# Altium project PCB_Project.PrjPcb (part 2 of 2)
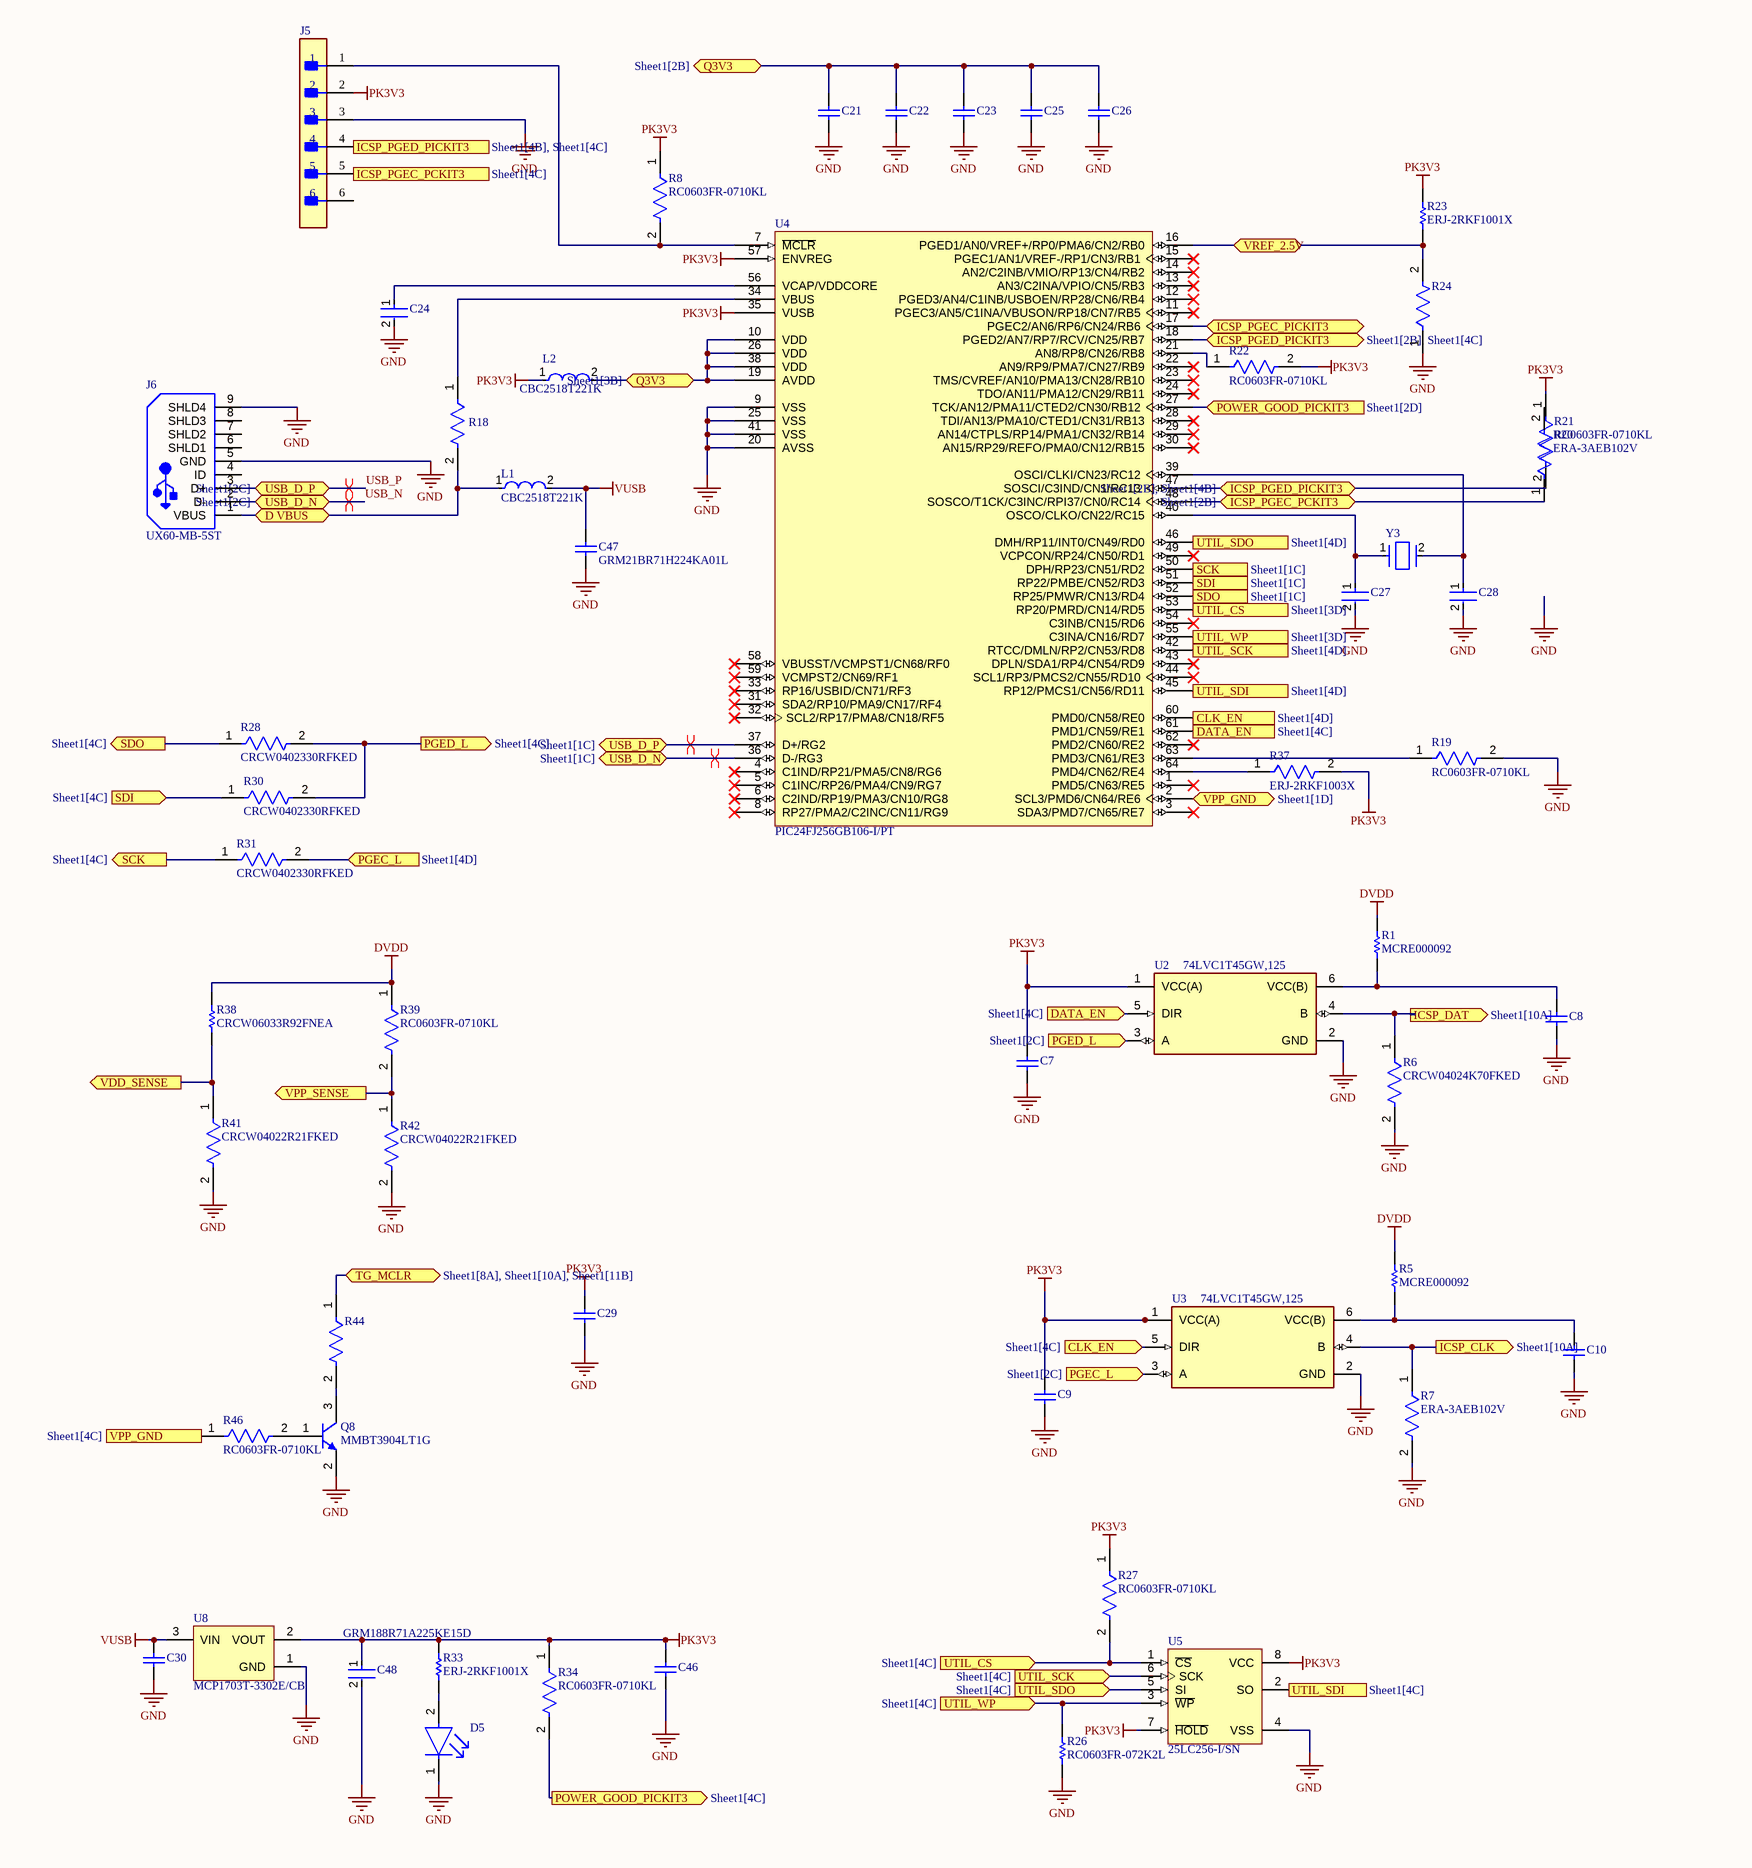
[diagram p3: Sheet1.SchDoc, bottom left]

## Sheet Sheet1.SchDoc (continued)

### Library data of the parts
C1 = CMP-1037-04981-1: CAP 10uF 25V -20% to +80% 1206 (3216 Metric) Thickness 1.9mm SMD; Case-EIA: 1206; Case-Metric: 3216; Value: 10uF; Tolerance: -20% to +80%; Max Thickness: 1.9 mm; Rated Voltage: 25 V; Technology: SMT
C2-C5 C7-C10 C21-C23 C25 C26 C29 C30 C46 = CMP-2100-03643-1: Chip Capacitor, 0.1 uF, +/- 10%, 50 V, -55 to 125 degC, 0603 (1608 Metric), RoHS, Tape and Reel; Manufacturer: Murata; Dielectric Material: Ceramic; Voltage Rating: 50V; Capacitance: 100nF; Dielectric: X7R; Insulation Resistance: 10GR; Case Code (Metric): 1608; Lead Free: LeadFree; Depth: 0.8mm; Number of Pins: 2; Radiation Hardening: No; Case/Package: 0603; Manufacturer URL: http://www.murata.com/; Packaging: TapeandReel; Length: 1.6mm; Contact Plating: Tin; Datasheet URL: http://psearch.en.murata.com/capacitor/product/GRM188R71H104KA93%23.pdf; Tolerance: 10%; Case Code (Imperial): 0603; Min Operating Temperature: -55degC; RoHSCompliant: true; Voltage: 50V; Termination: SMD/SMT; Mount: SurfaceMount; Material: Ceramic; Package Quantity: 1; Height: 0.8mm; Thickness: 0.035inch; REACH SVHC: NoSVHC; Max Operating Temperature: 125degC; Width: 0.8mm; Package Reference: 0603; Voltage Rating (DC): 50V; Datasheet Version: 42675.0; Package Description: 2-Pin Surface Mount Device, Body 1.6 x 0.8 mm
C11 C33 = CMP-2006-01581-1: Manufacturer: Vitramon; Part Number: VJ0603Y104JXACW1BC
C12 = CMP-1036-04555-1: CAP 220nF 50V ±20% 0805 (2012 Metric) Thickness 1mm SMD; Tolerance: Â±20%; Case-EIA: 0805; Case-Metric: 2012; Rated Voltage: 50 V; Max Thickness: 1 mm; Value: 220nF; Technology: SMT
C13 C14 = CMP-1659-00027-1: Chip Capacitor, 27 pF, +/- 5%, 50 V, -55 to 125 degC, 0603 (1608 Metric), RoHS, Tape and Reel; Capacitance: 10 uF; Tolerance: 10%; Voltage Rating (DC): 16 V; Case\Package: 1206; Type (Capacitors): X7R; Width: 1.6 mm; Pins: 2; Height: 1.6 mm; RoHSCompliant: true; PackageDescription: 2-Pin Surface Mount Device, Body 1.6 x 0.8 mm; Package Quantity: 2000; ComponentLink1Description: Manufacturer URL; Voltage Rating: 16 V; REACH SVHC: No SVHC; ComponentLink2Description: Datasheet; ComponentLink2URL: http://www.yageo.com/NewPortal/yageodocoutput?fileName=/pdf/MLCC/UPY-GP_NP0_16V-to-50V_14.pdf; Min Operating Temperature: -55 degC; PackageReference: 0603; Mount: Surface Mount; Case Code (Metric): 3216; Packaging: Tape and Reel; Radiation Hardening: No; DatasheetVersion: Rev. 14, 07/2016; Case Code (Imperial): 1206; ComponentLink1URL: http://www.yageo.com/; Max Operating Temperature: 125 degC; Length: 3.2 mm
C16 C19 = CMP-2000-06207-2: CAP ALUM 10UF 20% 50V SMD; Impedance: 880mR; Ripple Current: 165mA; Polarity: Polar; Leakage Current: 3uA; Lead Diameter: 0.65mm; Life (Hours): 2000Hour; REACH SVHC: No SVHC; Series: FK; Max Operating Temperature: 105°C; Radiation Hardening: No; Size: 5.8mm; Ripple Current (AC): 165mA; Lead Free: Lead Free; Voltage: 50V; Contact Plating: Tin; Case/Package: Radial; RoHS Compliant: Yes; Voltage Rating: 50V; Height - Seated (Max): 0.24inch; Package Quantity: 1000; Termination: SMD/SMT; Number of Pins: 2; Mount: Surface Mount; Packaging: Tape and Reel; Length: 5.8mm; Width: 7.8mm; Min Operating Temperature: -55°C; Height: 5.8mm; ESR (Equivalent Series Resistance): 880mR; Capacitance: 10uF; Diameter: 6.3mm; Voltage Rating (DC): 50V; Construction: Cylindrical; Tolerance: 20%; Lead Pitch: 1.8mm
C18 = CMP-2006-03061-2: CAP CER 0.1UF 50V X7R 0603; Manufacturer: KEMET; Manufacturer Part Number: C0603C104K5RACTU; Tolerance: 0.1; Description: C0603 0.10 μF X7R 30ppm/°C 10.00% 50 V; Temperature Coefficient: 30ppm/°C; Material: Ceramic; Automotive Grade: Grade 1; Value: 0.10 μF; Temperature: -55°C to +125°C; RoHS: TRUE; Temperature Range High: +125°C; Lead Free: Yes; Octopart: https://octopart.com/c0603c104k5ractu-kemet-139244; Digikey Description: CAP CER 0.1UF 50V X7R 0603; Category: Cap; Package: C0603C-CF; ComponentLink2Description: Datasheet; Temperature Range Low: -55°C; Device Class L1: Passive Components; Voltage Rating: 50 V; Automotive: Yes; Device Class L3: Ceramic Capacitors; ComponentLink2URL: https://api.kemet.com/component-edge/download/datasheet/C0603C100J5GACAUTO.pdf; Capacitance: 0.10 μF; Device Class L2: Capacitors; Temperature Characteristic: X7R; Height: 0.87mm
C20 = CMP-1036-03264-2: CAP CER 2200PF 50V X7R 0805; Manufacturer: Yageo; Capacitance: 2.2 nF; Tolerance: 0.1; Material: Ceramic; Value: 2.2 nF; Height: 0.95mm; Package: CC0805-0.85; Device Class L2: Capacitors; Lead Free: Yes; Device Class L1: Passive Components; Octopart: https://octopart.com/cc0805krx7r9bb222-yageo-192982; Temperature Range High: +85°C; Temperature Range Low: -30°C; Footprint Url: http://www.yageo.com/exep/pages/download/literatures/UPY-C_GEN_24.pdf; Temperature Characteristic: X7R; Manufacturer Part Number: CC0805KRX7R9BB222; Mouser Description: 2200pF Surface Mount, MLCC 0805 (2012 Metric) Package Ceramic Capacitors; Device Class L3: Ceramic Capacitors; RoHS: TRUE; Ipc Land Pattern Name: CAPC200125X85; ComponentLink2URL: http://www.yageo.com/documents/recent/UPY-GPHC_Y5V_6.3V-to-50V_8.pdf; Digikey Description: CAP CER 2200PF 50V X7R 0805; Temperature: -30°C to +85°C; Category: Cap; Automotive: No; Voltage Rating: 50 V; ComponentLink2Description: Datasheet
C24 = CMP-2007-03541-2: Chip Multilayer Ceramic Capacitors for General Purpose, 0805, 10uF, X5R, 15%, 10%, 25V; Length: 2mm; Depth: 1.25mm; Termination: SMD/SMT; Voltage: 25V; Height: 1.25mm; Material: Ceramic; Thickness: 0.053inch; Radiation Hardening: No; Min Operating Temperature: -55°C; Width: 0.049inch; Package Quantity: 1; Mount: Surface Mount; Dielectric: X5R; Packaging: Tape and Reel; Capacitance: 10uF; Voltage Rating (DC): 25V; Lead Free: Lead Free; Max Operating Temperature: 85°C; Case Code (Imperial): 0805; Case/Package: 0805; Tolerance: 10%; Voltage Rating: 25V; Case Code (Metric): 2012
C27 C28 = CMP-1034-00963-6: CAP CER 27PF 50V C0G/NP0 0402; Manufacturer: Kemet; Manufacturer Part Number: C0402C270J5GACTU; Temperature Coefficient: 15%; Tolerance: 0.05; Temperature Characteristic: C0G; Material: Ceramic; Device Class L1: Passive Components; Device Class L3: Ceramic Capacitors; RoHS: TRUE; Height: 0.55mm; Value: 27 pF; Device Class L2: Capacitors; Capacitance: 27 pF; Automotive: No; Octopart: https://octopart.com/c0402c270j5gactu-kemet-149444; Temperature: -55°C to +125°C; Temperature Range Low: -55°C; Package: C0402-BB; Ipc Land Pattern Name: CAPC10050X50; Category: Cap; Lead Free: Yes; Temperature Range High: +125°C; ComponentLink2URL: https://content.kemet.com/datasheets/KEM_C1002_X7R_SMD.pdf; ComponentLink2Description: Datasheet; Mouser Description: Multilayer Ceramic Capacitor, C Series, 27 pF, - 5%, C0G / NP0, 50 V, 0402 [1005 Metric]; Digikey Description: CAP CER 27PF 50V C0G/NP0 0402; Voltage Rating: 50 V
C31 = CMP-2006-02908-5: Chip Capacitor, 2.2 nF, +/- 10%, 50 V, -55 to 125 degC, 0603 (1608 Metric), RoHS, Tape and Reel; Manufacturer: Murata; Voltage Rating: 50 V; Pins: 2; Mount: Surface Mount; Max Operating Temperature: 125 degC; ComponentLink1Description: Manufacturer URL; RoHSCompliant: true; PackageDescription: 2-Pin Surface Mount Device, Body 1.6 x 0.8 mm; ComponentLink2URL: http://search.murata.co.jp/Ceramy/image/img/A01X/G101/ENG/GRM188R71H222KA01-01.pdf; PackageReference: 0603; Height: 0.8 mm; Lead Pitch: 4 mm; Packaging: Tape and Reel; DatasheetVersion: 02/2016; Mounting Technology: Surface Mount; ComponentLink2Description: Datasheet; Min Operating Temperature: -55 degC; Length: 1.6 mm; REACH SVHC: No SVHC; Package Quantity: 4000; ComponentLink1URL: http://www.murata.com/
C47 = CMP-2007-03583-1: Manufacturer: Murata; Part Number: GRM21BR71H224KA01L
C48 = CMP-2006-02836-2: Chip Multilayer Ceramic Capacitors for General Purpose, 0603, 2.2uF, X7R, 15%, 10%, 10V; Case Code (Metric): 1608; Height: 0.8mm; Packaging: Cut Tape; Voltage: 10V; Lead Free: Lead Free; Min Operating Temperature: -55°C; Voltage Rating (DC): 10V; Max Operating Temperature: 125°C; Voltage Rating: 10V; Dielectric: X7R; Depth: 0.8mm; Case Code (Imperial): 0603; Termination: SMD/SMT; Case/Package: 0603; Number of Pins: 2; REACH SVHC: No SVHC; Mount: Surface Mount; Width: 0.031inch; Material: Ceramic; Capacitance: 2.2uF; Package Quantity: 1; Weight: 7.1E-05oz; Length: 1.6mm; Thickness: 0.035inch; Tolerance: 10%
D1 = CMP-0894-00007-3: Surface Mount Standard Recovery Power Rectifier, 2-Pin SMA, Pb-Free, Tape and Reel; Manufacturer: On Semiconductor; VRRM Max (V): 300; IFSM Max (A): 30; IO(rec) Max (A): 1; PackageReference: SMA-2-403D-02; ComponentLink3Description: Package Specification; RoHS: TRUE; PackageDescription: 2-Pin Small Molded Package, J-Bend Lead, Body 2.605 x 4.315 mm; ComponentLink1URL: http://www.onsemi.com/; PackageVersion: Rev. G, 07/2012; Mounting Technology: Surface Mount; DatasheetVersion: Rev. 9; Type: Standard Recovery; ComponentLink3URL: http://www.onsemi.com/pub_link/Collateral/403D-02.PDF; ComponentLink1Description: Manufacturer URL; PartNumber: MRA4003T3G; ComponentLink2URL: http://www.onsemi.com/pub_link/Collateral/MRA4003T3-D.PDF; ComponentLink2Description: Datasheet; Packing: Tape and Reel
D2 = CMP-1060-00506-1: Zener Voltage Regulator, 500 mW, 2-Pin SOD-123, Pb-Free, Tape and Reel; Manufacturer: On Semiconductor; P Max (W): 0.5; ComponentLink2URL: http://www.onsemi.com/pub_link/Collateral/MMSZ2V4T1-D.PDF; PackageDescription: 2-Pin SOD, Body 1.6 x 2.69 mm; PackageReference: SOD-123-2-425-04; ComponentLink3Description: Package Specification; Packing: Tape and Reel; PackageVersion: Rev. G, 10/2009; ComponentLink1URL: http://www.onsemi.com/; RoHS: Pb-Free; PartNumber: MMSZ43T1G; Mounting Technology: Surface Mount; DatasheetVersion: Rev. 11; ComponentLink2Description: Datasheet; ComponentLink3URL: http://www.onsemi.com/pub_link/Collateral/425-04.PDF; ComponentLink1Description: Manufacturer URL
D3 = CMP-1054-00056-1: High Voltage Switching Diode, 2-Pin SOD-323, Pb-Free, Tape and Reel; Manufacturer: On Semiconductor; Configuration: Single; trr Max (ns): 50; IF Max (A): 0.2; ComponentLink1Description: Manufacturer URL; Mounting Technology: Surface Mount; DatasheetVersion: Rev. 10; ComponentLink1URL: http://www.onsemi.com/; PackageReference: SOD-323-2-477-02; PartNumber: BAS21HT1G; RoHS: TRUE; ComponentLink3URL: http://www.onsemi.com/pub_link/Collateral/477-02.PDF.1; ComponentLink3Description: Package Specification; PackageVersion: Rev. H, 03/2007; ComponentLink2Description: Datasheet; PackageDescription: 2-Pin SOD, Body 1.7 x 1.25 mm; Packing: Tape and Reel; ComponentLink2URL: http://www.onsemi.com/pub_link/Collateral/BAS21HT1-D.PDF
D4 = CMP-1060-00137-1: 3 W Zener Voltage Regulator, 2-Pin SMB, Pb-Free, Tape and Reel; Manufacturer: On Semiconductor; VZ Typ (V): 27; Mounting Technology: Surface Mount; PackageVersion: Rev. H, 05/2011; ComponentLink1Description: Manufacturer URL; ComponentLink1URL: http://www.onsemi.com/; ComponentLink3Description: Package Specification; ComponentLink2URL: http://www.onsemi.com/pub_link/Collateral/1SMB5913BT3-D.PDF; DatasheetVersion: Rev. 8; RoHS: Pb-Free; ComponentLink2Description: Datasheet; PackageReference: SMB-2-403A-03_H; PartNumber: 1SMB5935BT3G; Packing: Tape and Reel; ComponentLink3URL: http://www.onsemi.com/pub_link/Collateral/1SMB5913BT3-D.PDF; PackageDescription: 2-Pin Small Molded Package, J-Bend Lead, Body 4.33 x 3.625 mm
D5 = CMP-22017-000005-2: LED GREEN CLEAR CHIP SMD; Dominant Wavelength: 569nm; Reverse Voltage: 5V; Lens Color: Colorless; Viewing Angle: 130°; Voltage: 2V; Forward Current: 30mA; Power Dissipation: 100mW; Luminous Intensity: 6mcd; Number of LEDs: 1; Forward Voltage: 2.1V; Wavelength: 565nm; Test Current: 10mA; Min Operating Temperature: -55°C; Lens Style: Clear; Mount: Surface Mount; Width: 0.8mm; Packaging: Tape and Reel; Lens Transparency: Clear; Case Code (Metric): 1608; Depth: 0.8mm; Case Code (Imperial): 0603; Case/Package: 0603; Number of Pins: 2; Max Operating Temperature: 85°C; Lead Free: Lead Free; Number of Elements: 1; Length: 1.6mm; Height: 0.8mm; Package Quantity: 1; Power Rating: 100mW; Radiation Hardening: No; Illumination Color: Green; Color: Green
J1 J7 = CMP-2000-05697-2: CONN HEADER VERT 3POS 2.54MM; Number of Positions: 3; Gasket: No (Without); High Speed Serial Data Connector: No; Current Rating: 3A; Contact Post Length: 0.125inch; PCB Thickness: 1.397mm; PCB Mount Retention: Without; Connector Type: Plug; Approvals: CSA; PCB Mounting Orientation: Vertical; Pitch: 2.54mm; Mating Alignment: No (Without); Housing Color: Black; Contact Gender: Male; Length: 7.21mm; Max Operating Temperature: 105°C; Strain Relief: No (Without); Contact Material: Bronze; Row Spacing: 2.54mm; Series: AMPMODU MOD II; Board Standoff: No (Without); Package Quantity: 520; Radiation Hardening: No; Contact Protection: No (Without); Stabilizers: No (Without); Number of Rows: 1; Contact Mating Length: 8.08mm; Contact Shape: Square; Depth: 2.54mm; Contact Current Rating: 3A; Flammability Rating: UL94 V-0; Packaging: Carton; Number of Contacts: 3; Orientation: Straight; Mount: Through Hole; Keyed: No; Contact Type: Male Pin; Housing Material: Thermoplastic; High Temperature Housing: No; ELV: Compliant; Contact Plating: Gold; Termination: Through Hole; Selectively Loaded: No (Without); Lead Free: Lead Free; Min Operating Temperature: -65°C; Mating Connector Lock: No (Without); Color: Black; RoHS Compliant: Yes
J2 = CMP-1502-00288-1: Male PCB Connector with Hex Screw WR-DSUB, 10.30 mm, Angled, 9 pins; Manufacturer: Wurth Elektronik; Pin Number: 9; Rated Current: 3A; Working Voltage: 125VAC; Contact Resistance: 30mOhm; Publisher: WurthElektronik; Datasheet URL: https://katalog.we-online.de/em/datasheet/6180xx231421.pdf; Operating Temperature: -40to85degC; Part Number: 618009231421; Mounting Technology: THT; Package Reference: 618009231421; Manufacturer URL: http://www.we-online.de; Gender: Male; Orientation: Angled; Packaging: Tray
J3 = CMP-1502-00016-1: Male Box Header WR-BHD, THT, Vertical, pitch 2.54 mm, 50 pins; Manufacturer: Wurth Elektronik; Pin Number: 50; Withstanding Voltage: 500VAC; Pitch: 2.54mm; Working Voltage: 250VAC; Contact Resistance: 20mOhm; Gender: Male; Orientation: Vertical; Part Number: 61205021621; Operating Temperature: -40to125degC; Publisher: WurthElektronik; Packaging: Tray; Manufacturer URL: http://www.we-online.de; Published Date: August2018; Mounting Technology: THT; Package Reference: 61205021621; Datasheet URL: https://katalog.we-online.de/em/datasheet/6120xx21621.pdf
J4 J9 = CMP-1502-02464-1: Serie 2141 - 3.50 mm Horizontal Entry Modular with Rising Cage Clamp WR-TBL, 2 pin; Manufacturer: Wurth Elektronik; Pin Number: 2; Pitch: 3.50mm; Datasheet URL: http://katalog.we-online.de/em/datasheet/6912141100xx.pdf; Packaging: Box; Mounting Technology: THT; Package Reference: 691214110002; Manufacturer URL: http://www.we-online.de; Part Number: 691214110002; Publisher: WurthElektronik; Operating Temperature: -40to105degC
J5 = CMP-02766-001548-1: CONN HEADER R/A 6POS 2MM; Gender: Male; Max Voltage Rating (AC): 500V; Max Current Rating: 3.9A; Number of Positions: 6; Packaging: Bulk; Insulation Color: Black; Contact Type: Male Pin; Series: TMM; Length: 12mm; Termination: Solder; Number of Rows: 1; Housing Material: Polymer; Min Operating Temperature: -55°C; Pitch: 2mm; Contact Shape: Square; Insulation Material: Polymer; Lead Free: Lead Free; Radiation Hardening: No; Depth: 5.97mm; Contact Plating: Tin; Contact Material: Bronze; Housing Color: Black; Orientation: Right Angle; Fastening Type: Pull; RoHS Compliant: Yes; Number of Contacts: 6; Max Operating Temperature: 105°C; Connector Type: Header; Contact Finish - Mating: TIN; REACH SVHC: No SVHC
J6 = CMP-2000-07375-1: USB Connector Mini B Type, 1 A, 5 V AC, -30 to 75 degC, 5-Pin SMD, RoHS, Tape and Reel; Manufacturer: Hirose Electric; No of Positions: 5; Style/Orientation: RightAngleSocket/Receptacle; Pitch: 0.8mm; Datasheet Version: 04/2008; Datasheet URL: http://datasheet.octopart.com/UX60-MB-5ST-Hirose-datasheet-8329595.pdf; Type: WiretoBoard; Package Reference: UX60-MB-5ST; Termination: SurfaceMount; Manufacturer URL: https://www.hirose.com; Mounting Technology: SurfaceMount; Package Description: 5-Pin Surface Mount Device, Body 7.7 x 9 mm, Pitch 0.8 mm
J8 = CMP-1502-02466-1: Serie 2141 - 3.50 mm Horizontal Entry Modular with Rising Cage Clamp WR-TBL, 3 pin; Manufacturer: Wurth Elektronik; Pin Number: 3; Pitch: 3.50mm; Package Reference: 691214110003; Mounting Technology: THT; Part Number: 691214110003; Manufacturer URL: http://www.we-online.de; Packaging: Box; Operating Temperature: -40to105degC; Publisher: WurthElektronik; Datasheet URL: http://katalog.we-online.de/em/datasheet/6912141100xx.pdf
J10 = CMP-1502-01070-1: THT Vertical Pin Header WR-PHD, Pitch 2.54 mm, Single Row, 6 pins; Manufacturer: Wurth Elektronik; Gender: Male; Pin Number: 6; Pitch: 2.54mm; Working Voltage: 250VAC; Rated Current: 3A; Withstanding Voltage: 500VAC; Contact Resistance: 20mOhm; Operating Temperature: -40to105degC; Packaging: Bag; Datasheet URL: https://katalog.we-online.de/em/datasheet/6130xx11121.pdf; Package Reference: 61300611121; Mounting Technology: THT; Publisher: WurthElektronik; Part Number: 61300611121; Manufacturer URL: http://www.we-online.de; Row Number: Single; Orientation: Vertical
JP1 = CMP-15831-000009-1: CONN HEADER VERT 2POS 2.54MM; Manufacturer: Harwin; Conn Gender: Male; Conn Orientation: Vertical; Number Of Contacts: 2; Current Rating: 3A; ComponentLink2URL: https://cdn.harwin.com/pdfs/M20-999.pdf; ComponentLink2Description: Datasheet; Package: M20-9990246; Temperature: -40°C to +105°C; Octopart: https://octopart.com/m20-9990246-harwin-2590635; Mouser Description: 2.54mm (0.1") Pitch SIL Vertical PC Tail Pin Header, 6.1mm mating pin height, tin, 2 contacts; Temperature Range High: +105°C; Device Class L1: Connectors; RoHS: TRUE; Automotive: No; Height: 8.99mm; Number Of Rows: 1; Contact Material: Tin,Nickel; Category: Conn; Pitch: 2.54mm; Lead Free: Yes; Digikey Description: CONN HEADER VERT 2POS 2.54MM; Manufacturer Part Number: M20-9990246; Temperature Range Low: -40°C; Device Class L3: unset; Device Class L2: Headers and Wire Housings
JP2 = CMP-02766-001458-1: CONN HEADER VERT 2POS 2.54MM; Gender: Male; Max Current Rating: 7.6A; Number of Contacts: 2; Max Voltage Rating (AC): 550V; Orientation: Straight; Depth: 2.54mm; Series: TSW; Package Quantity: 1; Min Operating Temperature: -55°C; Max Operating Temperature: 125°C; Contact Type: Male Pin; Contact Shape: Square; Color: Black; Housing Color: Black; Connector Type: Header; Fastening Type: Pull; Radiation Hardening: No; Pitch: 2.54mm; Housing Material: Polyester; Mount: Through Hole; Number of Positions: 2; Number of Rows: 1; Contact Material: Bronze; Insulation Color: Black; Contact Finish - Mating: GOLD; Termination: Solder; Insulation Material: PBT; Length: 5.08mm; Flammability Rating: UL94 V-0; Contact Mating Length: 0.23inch; REACH SVHC: No SVHC; Contact Plating: Gold; RoHS Compliant: Yes; Packaging: Bulk
L1 L2 = CMP-14484-000106-1: SMD Inductors 220uH ±10% 0.11A 10.92Ω 1007; Core Material: Ferrite; Shielding: Unshielded; Max DC Current: 110mA; Test Frequency: 796kHz; Self Resonant Frequency: 5.5MHz; DC Resistance (DCR): 10.92R; Saturation Current: 115mA; RoHS Compliant: Yes; Height - Seated (Max): 0.079inch; Mount: Surface Mount; Height: 1.8mm; Lead Free: Lead Free; Termination: SMD/SMT; Package Quantity: 2000; Series: CB; Packaging: Tape and Reel; Case Code (Imperial): 1007; Max Operating Temperature: 105°C; Tolerance: 10%; Inductance Tolerance: 10%; Current Rating: 110mA; Halogen Free: Halogen Free; Depth: 2mm; Resistor Type: Wirewound; Min Operating Temperature: -40°C; Military Standard: Not; Case/Package: 1007; DC Current: 110mA; Radiation Hardening: No; Width: 1.8mm; Inductance: 220uH; Case Code (Metric): 2518; Length: 0.098inch
LED1-LED3 = CMP-22017-000041-1: LED RED CLEAR CHIP SMD; Dominant Wavelength: 631nm; Lens Color: Colorless; Lens Style: Diffused; Forward Voltage: 2V; Test Current: 20mA; Luminous Intensity: 54mcd; Number of LEDs: 1; Viewing Angle: 130°; Power Rating: 75mW; Forward Current: 30mA; Wavelength: 639nm; Reverse Voltage: 5V; Min Operating Temperature: -55°C; Height: 1.1mm; Length: 3.2mm; Lens Transparency: Clear; Case/Package: 1206; Package Quantity: 1; Width: 1.6mm; Max Operating Temperature: 85°C; Packaging: Tape and Reel; RoHS Compliant: Yes; Mount: Surface Mount; Lead Free: Lead Free; Depth: 1.6mm; Power Dissipation: 75mW; Number of Pins: 2; Number of Elements: 1; Color: Red; Illumination Color: Red; Case Code (Imperial): 1206; Case Code (Metric): 3216; Radiation Hardening: No
Q8 = CMP-1048-00631-1: General Purpose Transistor, NPN Silicon, 3-Pin SOT-23, Pb-Free, Tape and Reel; Manufacturer: On Semiconductor; IC Continuous (A): 0.2; fT Min (MHz): 300; ComponentLink2Description: Datasheet; Polarity: NPN; PackageDescription: 3-Pin Small Outline Transistor, Body 2.92 x 1.3 mm, Pitch 0.95 mm; ComponentLink2URL: http://www.onsemi.cn/pub_link/Collateral/MMBT3904LT1-D.PDF; DatasheetVersion: Rev. 12; Mounting Technology: Surface Mount; PartNumber: MMBT3904LT1G; ComponentLink1URL: http://www.onsemi.com/; ComponentLink3Description: Package Specification; ComponentLink1Description: Manufacturer URL; PackageVersion: Rev. AP, 11/2009; PackageReference: SOT-23-3-318-08; Packing: Tape and Reel; ComponentLink3URL: http://www.onsemi.cn/pub_link/Collateral/318-08.PDF; RoHS: TRUE
R1 R5 = CMP-2004-02460-1: Manufacturer: Multicomp; Part Number: MCRE000092
R2-R4 R7 R17 R20 R25 R29 R36 R47 = CMP-2000-00873-2: RES SMD 1K OHM 0.1% 1/10W 0603; Temperature Coefficient: 25ppm/°C; Voltage Rating: 75V; Max Power Dissipation: 100mW; Resistance: 1kR; Technology: METAL FILM; Number of Pins: 2; Packaging: Tape and Reel; Case Code (Imperial): 0603; Case Code (Metric): 1608; Min Operating Temperature: -55°C; REACH SVHC: No SVHC; Length: 1.6mm; Termination: SMD/SMT; Depth: 0.8mm; Resistance Tolerance: 0.1%; Number of Terminations: 2; Width: 0.8mm; Military Standard: Not; Tolerance: 0.1%; Package Quantity: 5000; Contact Plating: Tin; Height: 0.45mm; Construction: Rectangular; Case/Package: 0603; Max Operating Temperature: 155°C; Resistor Type: Thin Film; Series: ERA-3A; Size Code: 0603; RoHS Compliant: Yes; Mount: Surface Mount; Radiation Hardening: No; Power Rating: 100mW
R6 = CMP-2002-00051-3: RES Thick Film, 4.7kΩ, 1%, 0.063W, 100ppm/°C, 0402; Voltage Rating (DC): 50V; Power Rating: 63mW; Resistance: 4.7kR; Termination: SMD/SMT; Military Standard: Not; Length: 1mm; Radiation Hardening: No; Max Operating Temperature: 155°C; Min Operating Temperature: -55°C; Package Quantity: 10; Width: 0.5mm; Case Code (Imperial): 0402; Number of Terminations: 2; Max Power Dissipation: 63mW; Tolerance: 1%; Features: Automotive AEC-Q200; Composition: Thick Film; Depth: 0.5mm; Mount: Surface Mount; Weight: 2.3E-05oz; Lead Free: Lead Free; Case/Package: 0402; Height: 0.35mm; Packaging: Tape and Reel; Temperature Coefficient: 100ppm/°C; Case Code (Metric): 1005; Voltage Rating: 50V; Contact Plating: Tin
R8 R10-R12 R16 R19 R21 R22 R27 R34 R39 R40 R45 R46 = CMP-2100-03664-2: RES 10K OHM 1% 1/10W 0603; Voltage Rating: 75V; Voltage Rating (DC): 50V; Resistance: 10kR; Power Rating: 100mW; Temperature Coefficient: 100ppm/°C; Depth: 0.8mm; Termination: SMD/SMT; Resistor Type: Thick Film; Series: RC; Construction: Rectangular; Features: Moisture Resistant; Packaging: Tape and Reel; Min Operating Temperature: -55°C; Number of Terminations: 2; Lead Pitch: 0.3mm; RoHS Compliant: Yes; Case/Package: 0603; Resistance Tolerance: 1%; Military Standard: Not; Weight: 7.1E-05oz; Number of Pins: 2; Tolerance: 1%; Length: 1.6mm; Case Code (Imperial): 0603; Lead Free: Lead Free; Width: 0.8mm; Max Power Dissipation: 100mW; Height: 0.45mm; Max Operating Temperature: 155°C; Case Code (Metric): 1608; Size Code: 0603
R9 = CMP-1666-00020-3: RES Thick Film, 120Ω, 1%, 0.1W, 100ppm/°C, 0603; Power Rating: 100mW; Working Voltage: 75V; Resistance: 120R; RoHS Compliant: Yes; Lead Free: Lead Free; Termination: SMD/SMT; Radiation Hardening: No; Case Code (Imperial): 0603; Series: CRCW; Resistance Tolerance: 1%; Number of Terminations: 2; Tolerance: 1%; Max Operating Temperature: 155°C; Contact Plating: Tin; Package Quantity: 10; Max Power Dissipation: 100mW; Case Code (Metric): 1608; Weight: 7.1E-05oz; Packaging: Tape and Reel; Mount: Surface Mount; Military Standard: Not; Construction: Rectangular; Features: Automotive AEC-Q200; Depth: 0.85mm; Min Operating Temperature: -55°C; Case/Package: 0603; Height: 0.45mm; Voltage Rating (DC): 75V; Width: 0.033inch; Technology: THICK FILM; Length: 1.55mm; Voltage Rating: 75V; Temperature Coefficient: 100ppm/°C; Resistor Type: Thick Film
R13 R43 R44 = CMP-02407-000418-1: RES SMD 100 OHM 1% 1/8W 0603; Voltage Rating: 75V; Power Rating: 100mW; Temperature Coefficient: 50ppm/°C; Max Power Dissipation: 125mW; Resistance: 10kR; Case/Package: 0603; Military Standard: Not; Min Operating Temperature: -55°C; Width: 0.8mm; Package Quantity: 1; Max Operating Temperature: 125°C; Tolerance: 1%; Depth: 0.85mm; Radiation Hardening: No; Mount: Surface Mount; Composition: Thin Film; Contact Plating: Tin; Lead Free: Lead Free; Case Code (Imperial): 0603; Number of Terminations: 2; Voltage Rating (DC): 75V; Length: 1.55mm; Packaging: Tape and Reel; Height: 0.022inch; Case Code (Metric): 1608
R14 = CMP-07234-000034-1: TRIMMER 25K OHM 0.5W PC PIN TOP; Temperature Coefficient: 100ppm/°C; Resistance Tolerance: 10%; Resistance: 25kR; Power Rating: 500mW; Number of Turns: 25; Voltage Rating (DC): 300V; Taper: Linear; Resistor Type: Cermet; REACH SVHC: No SVHC; Height: 0.395inch; Military Standard: Not; Color: Blue; Tolerance: 10%; Depth: 4.83mm; Package Quantity: 50; Termination: Pin; Radiation Hardening: No; Packaging: Rail/Tube; Lead Free: Lead Free; Length: 9.53mm; Series: 3296; Weight: 0.03oz; RoHS Compliant: Yes; Mount: Panel; Max Power Dissipation: 500mW; Width: 9.53mm; Technology: CERMET; Min Operating Temperature: -55°C; Max Operating Temperature: 125°C
R15 R26 = CMP-2000-06934-1: Thick Film Resistor, 2.2 KOhm, 100 mW, 50 V, +/- 1%, -55 to 155 degC, 2-Pin SMD (0603), RoHS, Tape and Reel; Manufacturer: Yageo; Resistance: 2.2kOhms; Temperature Coefficient: 100PPM/C; Voltage Rating: 50V; Power Rating: 100mW; Tolerance: 1%; Datasheet Version: Rev. 7, 05/2017; Case Code - mm: 1608; Series: RC; Mounting Technology: SurfaceMount; Package Description: 2-Pin Surface Mount Device, Body 1.6 x 0.8 mm; Case Code - in: 0603; Package Reference: 0603; Product: ThickFilmResistorsGeneralPurpose; Manufacturer URL: http://www.yageo.com/; Termination Style: SMD/SMT; Operating Temperature Range: -55Cto+155C; Datasheet URL: http://www.yageo.com/documents/recent/PYu-RC_Group_51_RoHS_L_7.pdf; Packaging: Reel
R18 R37 = CMP-2002-00608-4: RES SMD 100K OHM 1% 1/10W 0402; Resistance: 100kR; Voltage Rating (DC): 50V; Power Rating: 100mW; Temperature Coefficient: 100ppm/°C; Case/Package: 0402; Length: 1mm; Package Quantity: 1; Radiation Hardening: No; Case Code (Metric): 1005; Contact Plating: Tin; Mount: Surface Mount; Depth: 0.5mm; Max Operating Temperature: 155°C; Lead Free: Lead Free; Width: 0.5mm; Composition: Thick Film; Case Code (Imperial): 0402; Tolerance: 1%; Termination: SMD/SMT; Number of Pins: 2; Height: 0.35mm; Voltage Rating: 50V; Military Standard: Not; REACH SVHC: No SVHC; Packaging: Tape and Reel; Min Operating Temperature: -55°C; Max Power Dissipation: 100mW; Features: Automotive AEC-Q200; Number of Terminations: 2
R23 R33 = CMP-1011-00510-4: Chip Resistor, 1 KOhm, +/- 1%, 100 mW, -55 to 155 degC, 0402 (1005 Metric), RoHS, Tape and Reel; Manufacturer: Basic Passives; Voltage Rating: 50 V; Case\/Package: 0402; Resistance: 1 KOhm; Power Rating: 100 mW; PartNumber: ERJ-2RKF1001X; DatasheetVersion: 04/2015; Radiation Hardening: No; Pins: 2; Height: 0.35 mm; RoHSCompliant: true; Case Code (Imperial): 0402; ComponentLink2Description: Datasheet; ComponentLink1Description: Manufacturer URL; PackageReference: 0402; Mount: Surface Mount; Package Quantity: 10000; Tolerance: 1%; ComponentLink1URL: http://www.panasonic.com/; PackageDescription: 2-Pin Surface Mount Device, Body 1 x 0.5 mm; Mounting Technology: Surface Mount; Case Code (Metric): 1005; ComponentLink2URL: http://industrial.panasonic.com/cdbs/www-data/pdf/RDA0000/AOA0000C86.pdf; REACH SVHC: Yes; Packaging: Tape and Reel; Max Operating Temperature: 155 degC; Min Operating Temperature: -55 degC; Width: 0.5 mm; Length: 1 mm
R24 = CMP-1012-00565-3: RES Thick Film, 3.16kΩ, 1%, 0.1W, 100ppm/°C, 0603; Voltage Rating (DC): 75V; Power Rating: 100mW; Resistance: 3.16kR; Max Operating Temperature: 155°C; Features: Automotive AEC-Q200; Package Quantity: 10; Tolerance: 1%; Temperature Coefficient: 100ppm/°C; Width: 0.033inch; Composition: Thick Film; Weight: 7.1E-05oz; Depth: 0.85mm; Number of Pins: 2; Voltage Rating: 75V; Military Standard: Not; Case/Package: 0603; Termination: SMD/SMT; Contact Plating: Tin; Length: 1.55mm; Lead Free: Lead Free; Packaging: Tape and Reel; Case Code (Metric): 1608; Height: 0.45mm; Case Code (Imperial): 0603; Radiation Hardening: No; Min Operating Temperature: -55°C; Max Power Dissipation: 100mW; Number of Terminations: 2
R28 R30 R31 = CMP-2002-08523-2: RES Thick Film, 330Ω, 1%, 0.063W, 100ppm/°C, 0402; Max Power Dissipation: 63mW; Voltage Rating (DC): 50V; Resistance: 330R; Case/Package: 0402; Packaging: Tape and Reel; Width: 0.5mm; Case Code (Metric): 1005; Radiation Hardening: No; Military Standard: Not; Contact Plating: Tin; Temperature Coefficient: 100ppm/°C; Lead Free: Lead Free; Power Rating: 63mW; Voltage Rating: 50V; Tolerance: 1%; Features: Automotive AEC-Q200; Case Code (Imperial): 0402; Composition: Thick Film; Weight: 2.3E-05oz; Package Quantity: 10; Min Operating Temperature: -55°C; Height: 0.35mm; Length: 1mm; Termination: SMD/SMT; Number of Terminations: 2; Depth: 0.5mm; Max Operating Temperature: 155°C
R32 R35 = CMP-1659-00039-1: Chip Resistor, 47 Ohm, +/- 1%, 0.1 W, -55 to 155 degC, 0603 (1608 Metric), RoHS, Tape and Reel; Power Rating: 100 mW; Voltage Rating: 50 V; Case\Package: 0603; Resistance: 75 Ohm; Min Operating Temperature: -55 degC; Packaging: Tape and Reel; Case Code (Metric): 1608; ComponentLink1Description: Manufacturer URL; Case Code (Imperial): 0603; ComponentLink1URL: http://www.yageo.com/; REACH SVHC: No SVHC; Height: 0.45 mm; PackageReference: 0603; PackageDescription: 2-Pin Surface Mount Device, Body 1.6 x 0.8 mm; Length: 1.6 mm; DatasheetVersion: Rev. 4, 02/2016; Mount: Surface Mount; Package Quantity: 5000; ComponentLink2Description: Datasheet; Tolerance: 1%; Max Operating Temperature: 155 degC; ComponentLink2URL: http://www.yageo.com/documents/recent/PYu-RC_Group_51_RoHS_L_04.pdf; RoHSCompliant: true
R38 = CMP-2000-03333-1: Manufacturer: Vishay Dale; Part Number: CRCW06033R92FNEA
R41 R42 = CMP-2002-08491-2: RES Thick Film, 2.21Ω, 1%, 0.063W, 100ppm/°C, 0402; Voltage Rating: 50V; Resistance: 2.21R; Max Power Dissipation: 63mW; Case Code (Metric): 1005; Features: Automotive AEC-Q200; Temperature Coefficient: 100ppm/°C; Military Standard: Not; Depth: 0.5mm; Height: 0.016inch; Length: 1mm; Termination: SMD/SMT; Radiation Hardening: No; Package Quantity: 10; Min Operating Temperature: -55°C; Lead Free: Lead Free; Packaging: Tape and Reel; Composition: Thick Film; Number of Terminations: 2; Max Operating Temperature: 155°C; Tolerance: 1%; Case Code (Imperial): 0402; Weight: 2.3E-05oz; Case/Package: 0402; Power Rating: 63mW; Contact Plating: Tin; Width: 0.02inch
S1-S3 = CMP-05618-000012-1: SWITCH TACTILE SPST-NO 0.02A 15V; Manufacturer: Panasonic; Manufacturer Part Number: EVQ-Q2U03W; Contact Current Rating: 20mA; Contact Resistance: 100mΩ; Description: Switch Tactile ON OFF SPST Round Button J-Bend 0.02A 15VDC 2.6N SMD Embossed T/R; Operating Force: 2.6N; Electromechanical Life: 200000Cycles; Height: 3.3mm; Device Class L3: Tactile Switches; Voltage Rating Dc: 15V; Temperature: -40°C to +85°C; Device Class L1: Electromechanical; Mount: Surface Mount; ComponentLink2Description: Datasheet; Automotive: No; Lead Free: Yes; Throw Configuration: SPST-NO; RoHS: TRUE; ComponentLink2URL: https://industrial.panasonic.com/cdbs/www-data/pdf/ATK0000/ATK0000C360.pdf; Package: EVQQ2; Temperature Range High: +85°C; Temperature Range Low: -40°C; Mouser Description: Tactile Switches 2.6NF 6.5x6.0x3.1mm; Digikey Description: SWITCH TACTILE SPST-NO 0.02A 15V; Octopart: https://octopart.com/evq-q2u03w-panasonic-1404553; Category: Switch; Device Class L2: Switches
S4 = CMP-05618-000012-1: SWITCH TACTILE SPST-NO 0.02A 15V; Manufacturer: Panasonic; Contact Current Rating: 20mA; Contact Resistance: 100mΩ; Description: Switch Tactile ON OFF SPST Round Button J-Bend 0.02A 15VDC 2.6N SMD Embossed T/R; Operating Force: 2.6N; Electromechanical Life: 200000Cycles; Height: 3.3mm; Device Class L3: Tactile Switches; Voltage Rating Dc: 15V; Temperature: -40°C to +85°C; Device Class L1: Electromechanical; Manufacturer Part Number: EVQ-Q2U03W; Mount: Surface Mount; ComponentLink2Description: Datasheet; Automotive: No; Lead Free: Yes; Throw Configuration: SPST-NO; RoHS: TRUE; ComponentLink2URL: https://industrial.panasonic.com/cdbs/www-data/pdf/ATK0000/ATK0000C360.pdf; Package: EVQQ2; Temperature Range High: +85°C; Temperature Range Low: -40°C; Mouser Description: Tactile Switches 2.6NF 6.5x6.0x3.1mm; Digikey Description: SWITCH TACTILE SPST-NO 0.02A 15V; Octopart: https://octopart.com/evq-q2u03w-panasonic-1404553; Category: Switch; Device Class L2: Switches
TP1 TP2 = CMP-2000-05181-2: PC TEST POINT MINIATURE BLACK; Body Material: Bronze; Plating: Silver; Inside Diameter: 1.27mm; Hole Diameter: 1.6mm; Number of Ports: 1; Outside Diameter: 2.54mm; Insulation: Insulated; Insulation Material: Nylon; Mount: Through Hole; RoHS Compliant: Yes; Series: THM; Height: 0.3inch; Termination: Through Hole; Material: Nylon; Packaging: Bulk; Contact Material: Bronze; REACH SVHC: No SVHC; Contact Plating: Silver; Orientation: Straight; Lead Free: Lead Free; Package Quantity: 100; Length: 7.62mm; Flammability Rating: UL94 V-0; Number of Contacts: 1; Diameter: 2.54mm; Housing Color: Black; Color: Black
U1 = CMP-06276-000010-1: IC MCU 16BIT 256KB FLASH 64TQFP; Manufacturer: Microchip; Max Supply Voltage: 5.5V; Number Of Adc Channels: 36; Number Of I2C Channels: 1; Number Of Timers/Counters: 7; Min Supply Voltage: 4.5V; Number Of Uart Channels: 2; Data Bus Width: 16bits; Number Of I/Os: 53; Nominal Supply Current: 4.5-29mA; Interface: I2C,SPI,UART,CAN; Memory Size: 256KBytes; Ram Size: 16KBytes; Number Of Pwm Channels: 3; Frequency: 70MHz; Max Junction Temp: +125°C; Automotive Grade: Grade 1; Standoff Height: 0.05mm; Manufacturer Part Number: DSPIC33EV256GM106-I/PT; Lead Free: Yes; Package: C04-085; ComponentLink2Description: Datasheet; Category: IC; Ambient Temperature Range High: +85°C; RoHS: TRUE; Digikey Description: IC MCU 16BIT 256KB FLASH 64TQFP; Memory Type: FLASH; Device Class L3: Microcontrollers; Ipc Land Pattern Name: QFP50P1200X1200X120-64; Temperature: -40°C to +85°C; Automotive: Yes; Mouser Description: MCU 16-Bit dsPIC33E dsPIC RISC 256KB Flash 5V 64-Pin TQFP Tray; Ambient Temperature Range Low: -40°C; Temperature Range High: +85°C; Device Class L2: Embedded Processors and Controllers; Number Of Spi Channels: 2; Number Of A/D Converters: 1; Octopart: https://octopart.com/dspic33ev256gm106-i%2Fpt-microchip-30896131; Height: 1.2mm; Core Architecture: dsPIC33E; ComponentLink2URL: http://ww1.microchip.com/downloads/en/DeviceDoc/dsPIC33EVXXXGM00X-10X-Family-Data-Sheet-DS70005144H.pdf; Number Of Cores: 1; Temperature Range Low: -40°C; Device Class L1: Integrated Circuits (ICs)
U2 U3 = CMP-14347-000008-1: IC TRNSLTR BIDIRECTIONAL 6TSSOP
U4 = CMP-0046-00186-2: General Purpose 16-Bit Flash Microcontroller with USB On-The-Go, 256KB Flash, 16KB SRAM, 64-Pin TQFP, Industrial Temperature; ComponentLink3URL: http://www.microchip.com/; ComponentLink1URL: http://ww1.microchip.com/downloads/en/DeviceDoc/39897c.pdf; ComponentLink3Description: Microchip.com Home; RevisionNote: Component URLs added.; PackageDescription: 64-Lead Thin Plastic Quad Flat Pack (PT) - 10x10x1mm Body, 2.00mm [TQFP]; ComponentLink2URL: http://www.microchip.com/stellent/groups/techpub_sg/documents/packagingspec/en012702.pdf; PackageVersion: revBB, Aug-2009; ComponentLink2Description: Packaging Specification; ComponentLink1Description: Datasheet; PackageReference: TQFP-PT64; DatasheetVersion: revC, Dec-2009; Code_JEDEC: MS-026
U5 = CMP-0165-00113-1: 256K SPI Bus Serial EEPROM, 8-Pin SOIC, Industrial Temperature; PackageVersion: revBB, Aug-2009; PackageReference: SOIC-SN8; PackageDescription: 8-Lead Plastic Small Outline (SN) - Narrow, 3.90mm Body [SOIC]; Code_JEDEC: MS-012; Code_IPC: SOIC127P600-8; DatasheetVersion: revF, May-2007
U6 = CMP-06279-000030-1: IC TRANSCEIVER HALF 1/1 8DFN; Supply Current: 70mA; Number of Transceivers: 1; Propagation Delay: 125ns; Max Supply Voltage: 5.5V; Min Supply Voltage: 4.5V; Data Rate: 1Mbps; Number of Pins: 8; Radiation Hardening: No; Mount: Surface Mount; Max Operating Temperature: 125°C; Case/Package: DFN; Nominal Supply Current: 70mA; Package Quantity: 120; Min Operating Temperature: -40°C; Lead Free: Lead Free; Series: 1/1; Packaging: Rail/Tube; Turn-On Delay Time: 125ns; RoHS Compliant: Yes
U7 = CMP-0192-00221-1: Low-Power Linear Active Thermistor IC, 3-Pin SOT-23, Extended Temperature, Tape and Reel; PackageDescription: 3-Lead Plastic Small Outline Transistor (TT) [SOT-23]; DatasheetVersion: revE, Apr-2009; Code_IPC: SOT23-3; PackageVersion: revBB, Aug-2009; PackageReference: SOT-23-TT3
U8 = CMP-0136-00759-1: 250 mA, 16V, Low Quiescent Current LDO Regulator, 3-Pin SOT-23A, Extended Temperature, Tape and Reel; PackageDescription: 3-Lead Plastic Small Outline Transistor (CB) [SOT-23A]; PackageVersion: revBB, Aug-2009; PackageReference: SOT-23A-CB3; DatasheetVersion: revD, Sep-2009
U10 = CMP-0186-00323-1: LIN Transceiver with Voltage Regulator, 6 to 18 V, -40 to 125 degC, 8-pin SOIC (SN8), Tube; Manufacturer: Microchip; ComponentLink2Description: Datasheet; ComponentLink3URL: http://www.microchip.com/stellent/groups/techpub_sg/documents/packagingspec/en012702.pdf; PackageVersion: C04-057C; ComponentLink4URL: http://www.microchip.com/MCP2021A; ComponentLink1Description: Manufacturer URL; ComponentLink3Description: Package Specification; ComponentLink2URL: http://ww1.microchip.com/downloads/en/DeviceDoc/22298A.pdf; PackageDescription: 8-Lead Plastic Small Outline, 4.9 x 3.9 mm Body, 1.27 mm Pitch; PackageReference: SOIC-SN8; Mounting Technology: Surface Mount; ComponentLink4Description: Product URL; DatasheetVersion: Rev. A; PartNumber: MCP2021A-500E/SN; ComponentLink1URL: http://www.microchip.com
X1 = CMP-27762-001729-1: CRYSTAL 8.0000MHZ 18PF SMD; Series Resistance: 80R; Tolerance: 30ppm; Frequency: 8MHz; Operating Frequency: 8 MHz; Packaging: Tape and Reel; Number of Pins: 2; Mount: Surface Mount; Package Quantity: 1000; Series: ABLS2; Min Operating Temperature: -40°C; Termination: SMD/SMT; Load Capacitance: 18pF; Lead Free: Lead Free; Frequency Tolerance: 30ppm; RoHS Compliant: Yes; Length: 11.4mm; Width: 4.7mm; Height: 0.13inch; ESR (Equivalent Series Resistance): 80R; Max Operating Temperature: 85°C; Depth: 4.7mm; Frequency Stability: 30ppm
Y3 = CMP-27762-010912-1: Crystal 12MHz ±20ppm 18pF SMD-2 6mm x 3.5mm; Frequency Stability: 30ppm; ESR (Equivalent Series Resistance): 60R; Length: 6mm; Lead Free: Lead Free; Operating Frequency: 12 MHz; Packaging: Tape and Reel; Mount: Surface Mount; Frequency Tolerance: 20ppm; Radiation Hardening: No; Depth: 3.5mm; Tolerance: 20ppm; Height: 0.055inch; Number of Pins: 2; Series: ABM7; Package Quantity: 1000; Frequency: 12MHz; Series Resistance: 60R; Min Operating Temperature: -40°C; Resistor Type: Ceramic; Width: 0.138inch; Case/Package: CSMD; Load Capacitance: 18pF; Max Operating Temperature: 85°C; Termination: SMD/SMT